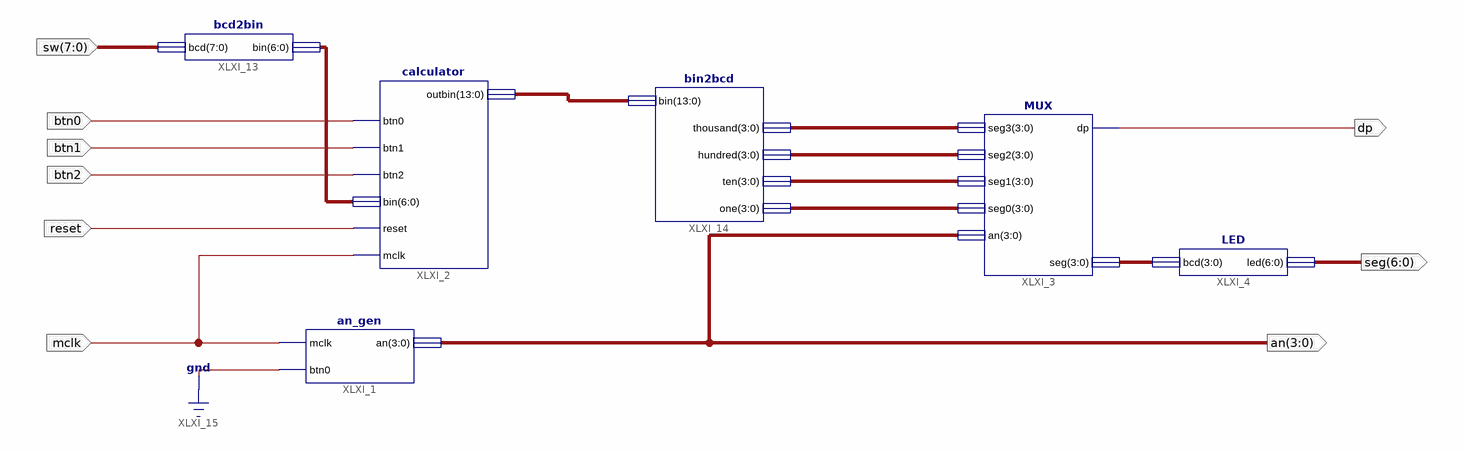
[diagram p0: schematic sheet 1]
// Xilinx ISE schematic cal.sch (spartan3e) as structural Verilog: 6 symbols, 9 ports
module cal (
  input  btn0,
  input  btn2,
  input  btn1,
  input  reset,
  input  [7:0] sw,
  input  mclk,
  output [3:0] an,
  output dp,
  output [6:0] seg
);

  wire [3:0] XLXN_27, XLXN_50, XLXN_51, XLXN_52, XLXN_53;
  wire [6:0] XLXN_30;
  wire [13:0] XLXN_33;

  calculator XLXI_2 (
    .btn0(btn0), .btn1(btn1), .btn2(btn2), .reset(reset), .bin(XLXN_30), .outbin(XLXN_33), .mclk(mclk));
  an_gen XLXI_1 (.mclk(mclk), .btn0(1'b0), .an(an));
  MUX XLXI_3 (.seg3(XLXN_53), .seg2(XLXN_52), .seg1(XLXN_51), .seg0(XLXN_50), .an(an), .dp(dp), .seg(XLXN_27));
  LED XLXI_4 (.bcd(XLXN_27), .led(seg));
  bcd2bin XLXI_13 (.bcd(sw), .bin(XLXN_30));
  bin2bcd XLXI_14 (.bin(XLXN_33), .thousand(XLXN_53), .hundred(XLXN_52), .ten(XLXN_51), .one(XLXN_50));
endmodule
